# EAGLE design BSPD (EAGLE 9.4.0)
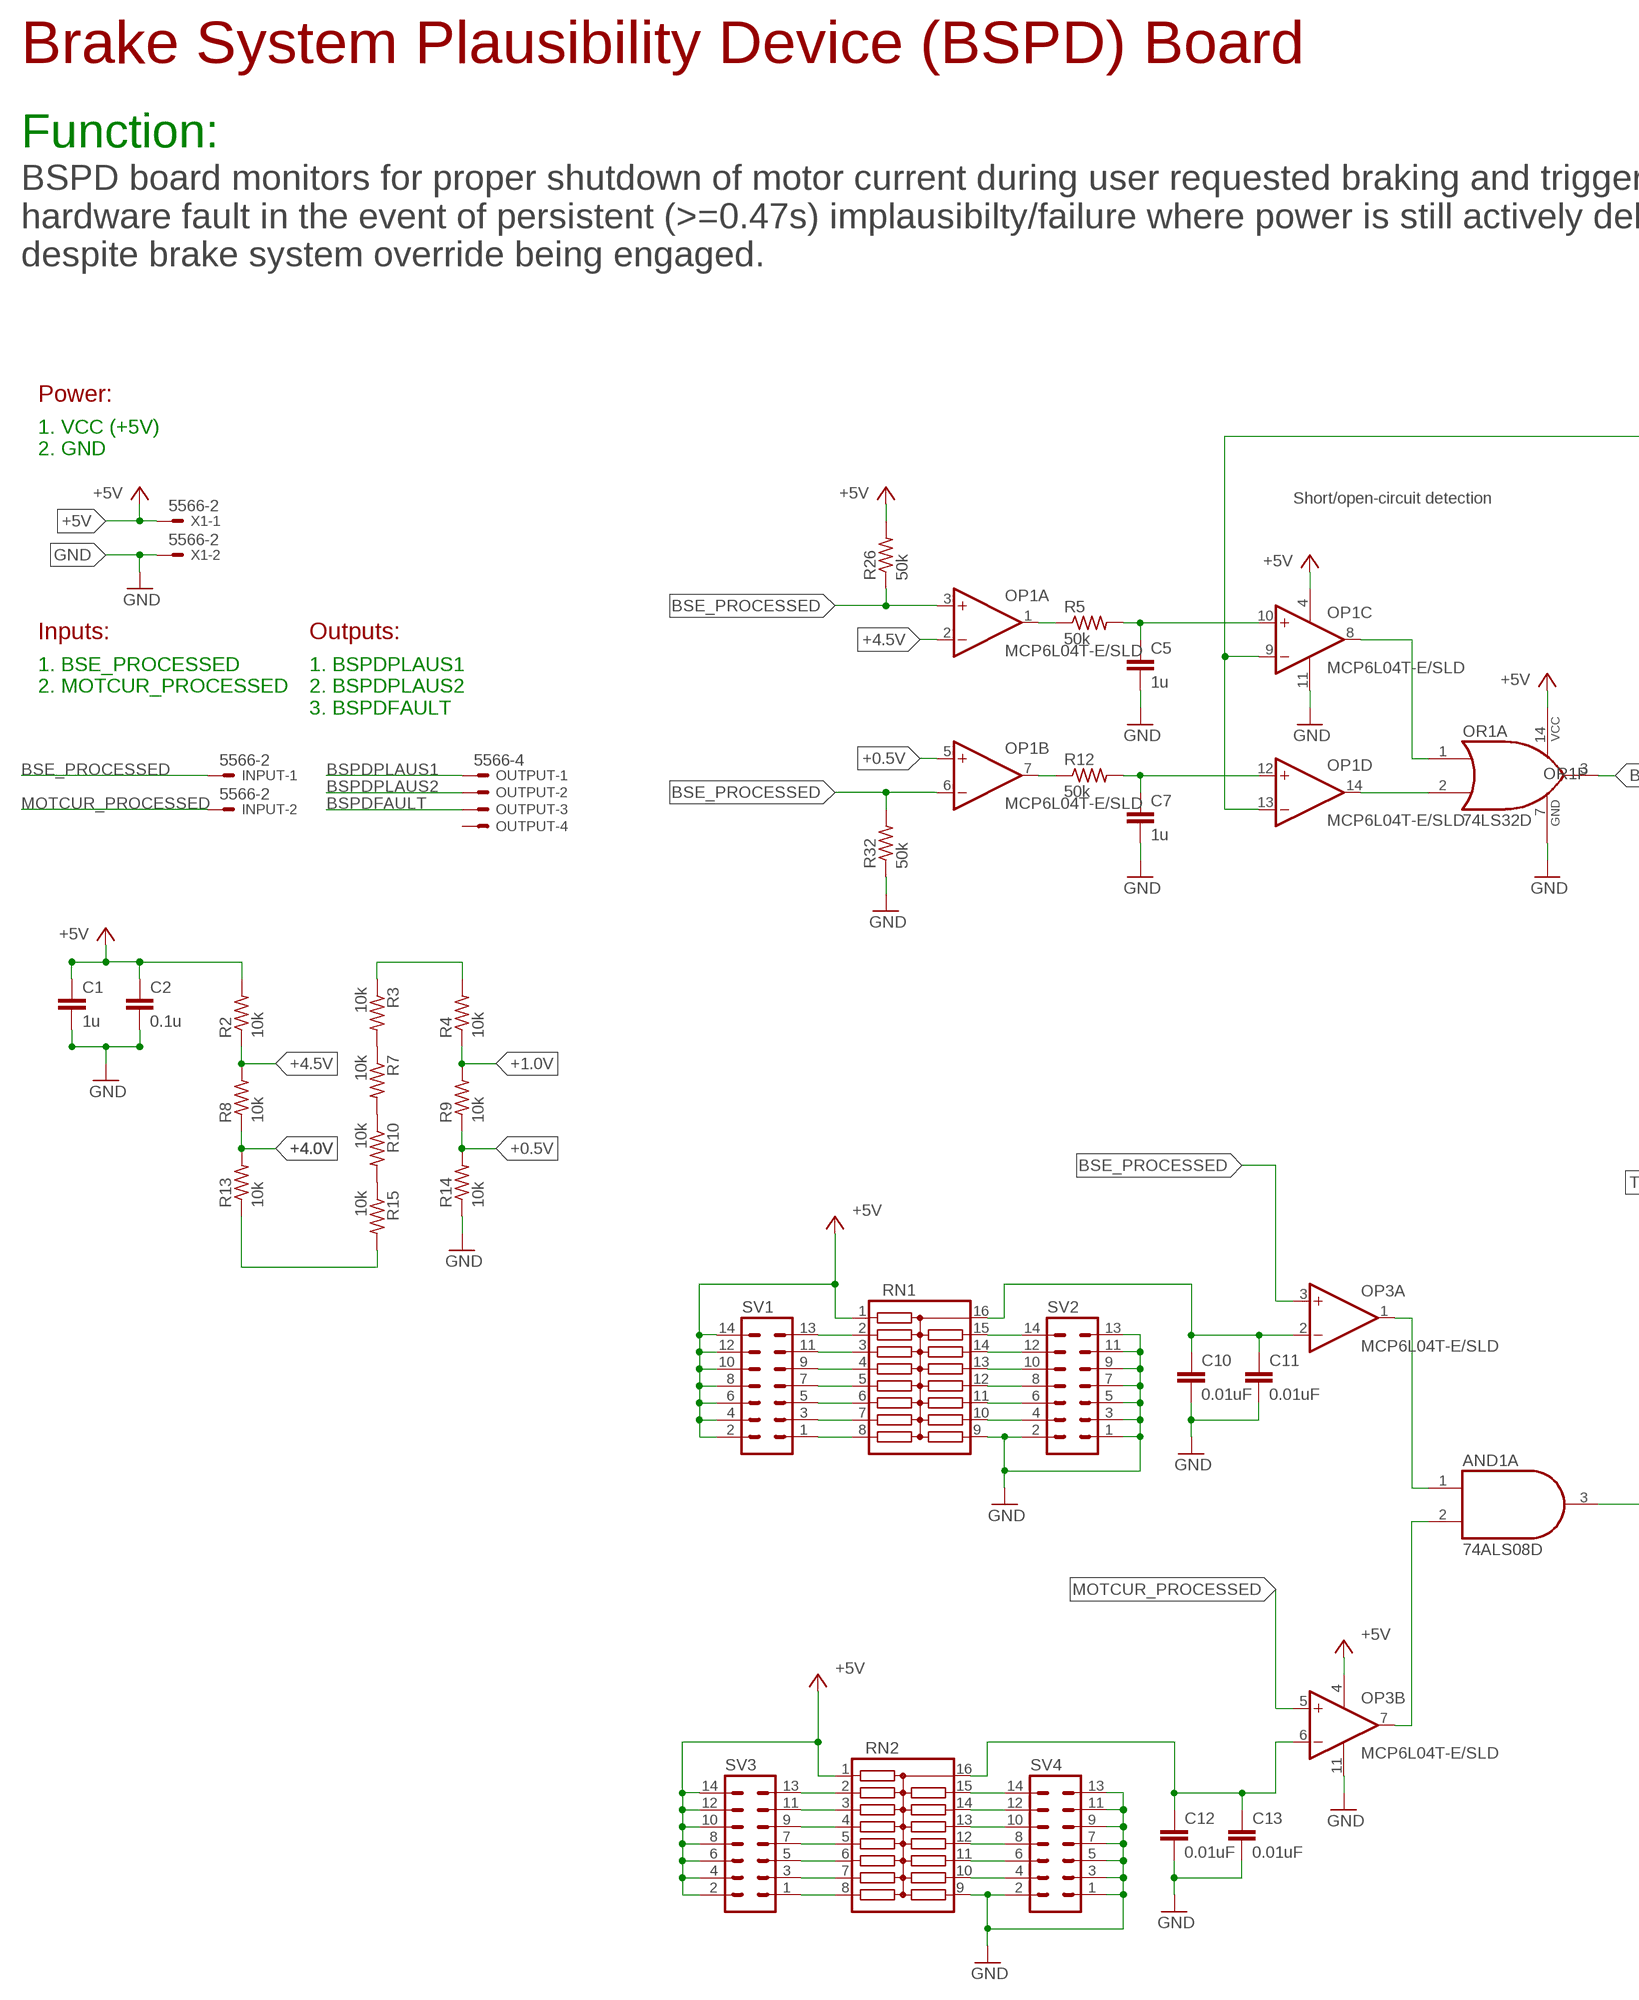
[diagram p0: schematic, sheet 1, part 1 of 2]
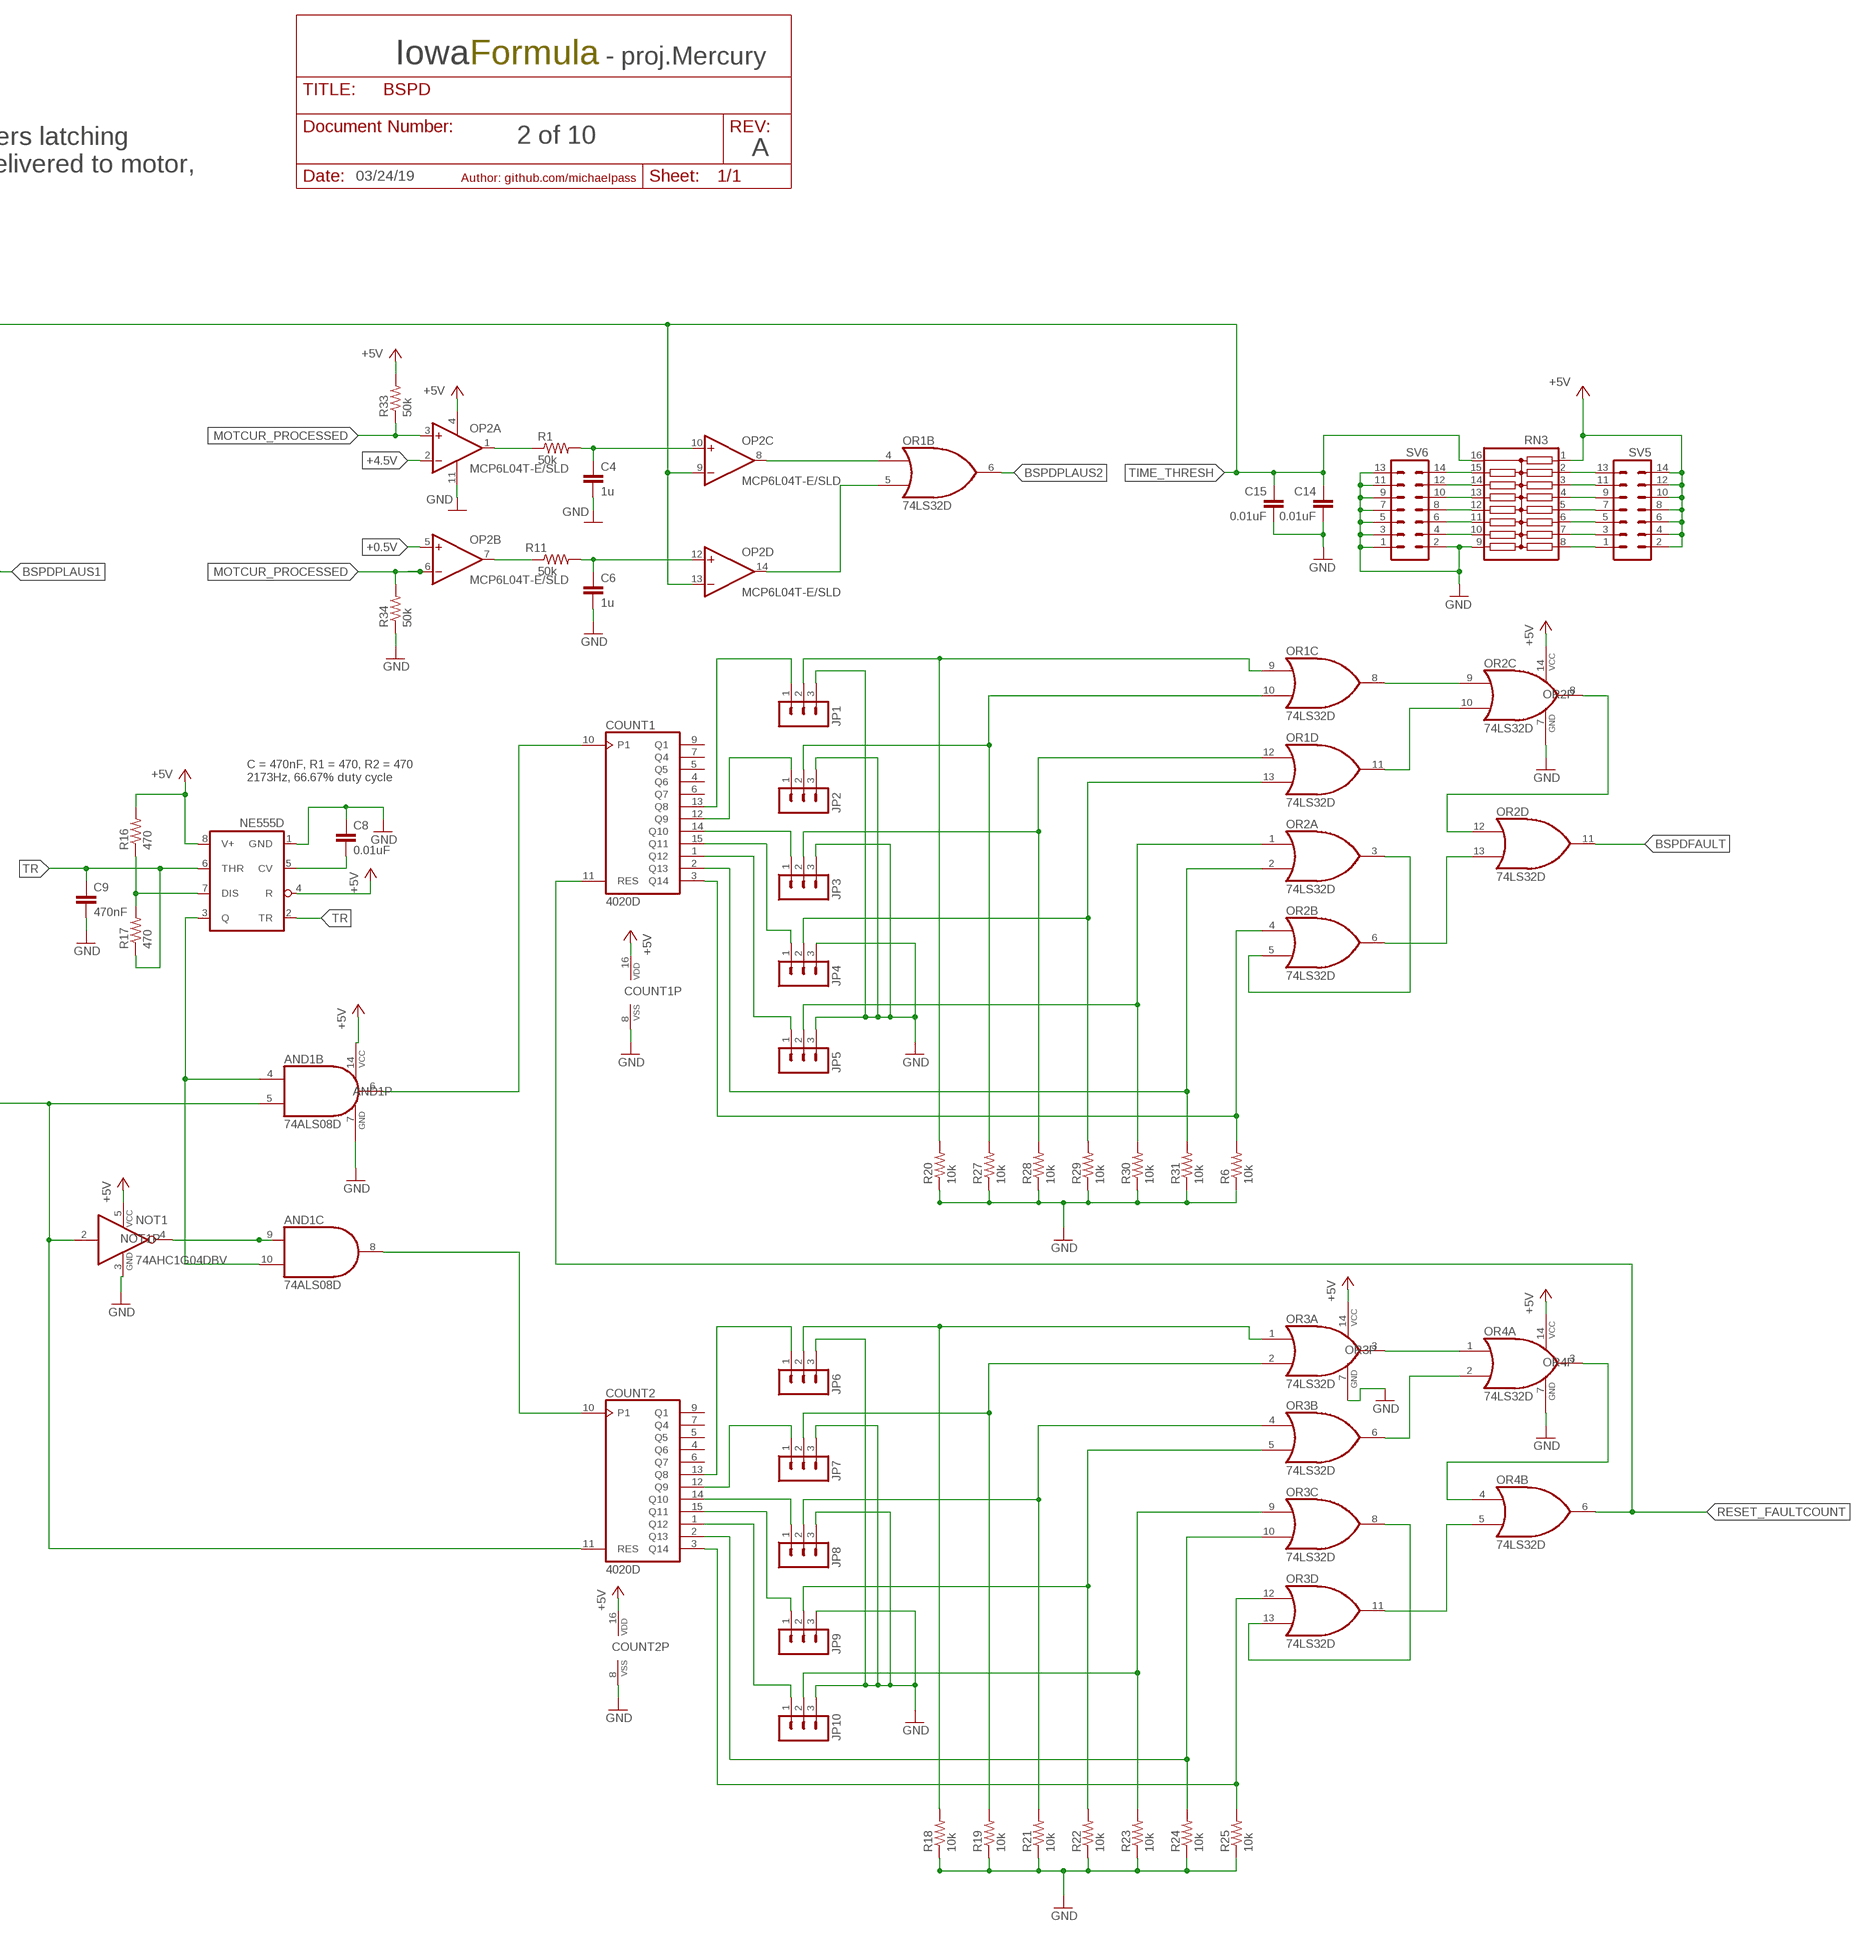
[diagram p1: schematic, sheet 1, part 2 of 2]

## Parts
AND1  74ALS08D  [SO14]
C1  1u  C-EUC0805  [C0805]
C2  0.1u  C-EUC0805  [C0805]
C4  1u  C-EUC0805  [C0805]
C5  1u  C-EUC0805  [C0805]
C6  1u  C-EUC0805  [C0805]
C7  1u  C-EUC0805  [C0805]
C8  0.01uF  C-EUC0805  [C0805]
C9  470nF  C-EUC0805  [C0805]
C10  0.01uF  C-EUC0805  [C0805]
C11  0.01uF  C-EUC0805  [C0805]
C12  0.01uF  C-EUC0805  [C0805]
C13  0.01uF  C-EUC0805  [C0805]
C14  0.01uF  C-EUC0805  [C0805]
C15  0.01uF  C-EUC0805  [C0805]
COUNT1  4020D  [SO16]
COUNT2  4020D  [SO16]
INPUT  5566-2  [5566-2]
JP1  MA03-1  [MA03-1]
JP2  MA03-1  [MA03-1]
JP3  MA03-1  [MA03-1]
JP4  MA03-1  [MA03-1]
JP5  MA03-1  [MA03-1]
JP6  MA03-1  [MA03-1]
JP7  MA03-1  [MA03-1]
JP8  MA03-1  [MA03-1]
JP9  MA03-1  [MA03-1]
JP10  MA03-1  [MA03-1]
NE555D  NE555D  [SO08]
NOT1  74AHC1G04DBV  [SOT23-5]
OP1  MCP6L04T-E/SLD  [SO14]
OP2  MCP6L04T-E/SLD  [SO14]
OP3  MCP6L04T-E/SLD  [SO14]
OR1  74LS32D  [SO14]
OR2  74LS32D  [SO14]
OR3  74LS32D  [SO14]
OR4  74LS32D  [SO14]
OUTPUT  5566-4  [5566-4]
R1  50k  R-US_R0805  [R0805]
R2  10k  R-US_R0805  [R0805]
R3  10k  R-US_R0805  [R0805]
R4  10k  R-US_R0805  [R0805]
R5  50k  R-US_R0805  [R0805]
R6  10k  R-US_R0805  [R0805]
R7  10k  R-US_R0805  [R0805]
R8  10k  R-US_R0805  [R0805]
R9  10k  R-US_R0805  [R0805]
R10  10k  R-US_R0805  [R0805]
R11  50k  R-US_R0805  [R0805]
R12  50k  R-US_R0805  [R0805]
R13  10k  R-US_R0805  [R0805]
R14  10k  R-US_R0805  [R0805]
R15  10k  R-US_R0805  [R0805]
R16  470  R-US_R0805  [R0805]
R17  470  R-US_R0805  [R0805]
R18  10k  R-US_R0805  [R0805]
R19  10k  R-US_R0805  [R0805]
R20  10k  R-US_R0805  [R0805]
R21  10k  R-US_R0805  [R0805]
R22  10k  R-US_R0805  [R0805]
R23  10k  R-US_R0805  [R0805]
R24  10k  R-US_R0805  [R0805]
R25  10k  R-US_R0805  [R0805]
R26  50k  R-US_R0805  [R0805]
R27  10k  R-US_R0805  [R0805]
R28  10k  R-US_R0805  [R0805]
R29  10k  R-US_R0805  [R0805]
R30  10k  R-US_R0805  [R0805]
R31  10k  R-US_R0805  [R0805]
R32  50k  R-US_R0805  [R0805]
R33  50k  R-US_R0805  [R0805]
R34  50k  R-US_R0805  [R0805]
RN1  15RSOMC  [SOMC16]
RN2  15RSOMC  [SOMC16]
RN3  15RSOMC  [SOMC16]
SV1  MA07-2  [MA07-2]
SV2  MA07-2  [MA07-2]
SV3  MA07-2  [MA07-2]
SV4  MA07-2  [MA07-2]
SV5  MA07-2  [MA07-2]
SV6  MA07-2  [MA07-2]
X1  5566-2  [5566-2]

## Nets
+0.5V: OP1.5(B:+IN) OP2.5(B:+IN) R9.1 R14.2
+1.0V: R4.1 R9.2
+4.0V: R8.1 R13.2
+4.5V: OP1.2(A:-IN) OP2.2(A:-IN) R2.1 R8.2
+5V: AND1.14(P:VCC) C1.1 C2.1 COUNT1.16(VDD) COUNT2.16(VDD) NE555D.4(R) NE555D.8(V+) NOT1.5(VCC) OP1.4(P:V+) OP2.4(P:V+) OP3.4(P:V+) OR1.14(P:VCC) OR2.14(P:VCC) OR3.14(P:VCC) OR4.14(P:VCC) R2.2 R16.2 R26.2 R33.2 RN1.1 RN2.1 RN3.1 SV1.2 SV1.4 SV1.6 SV1.8 SV1.10 SV1.12 SV1.14 SV3.2 SV3.4 SV3.6 SV3.8 SV3.10 SV3.12 SV3.14 SV5.2 SV5.4 SV5.6 SV5.8 SV5.10 SV5.12 SV5.14 X1.1
BSE_PROCESSED: INPUT.1 OP1.3(A:+IN) OP1.6(B:-IN) OP3.3(A:+IN) R26.1 R32.2
BSPDFAULT: OR2.11(D:O) OUTPUT.3
BSPDPLAUS1: OR1.3(A:O) OUTPUT.1
BSPDPLAUS2: OR1.6(B:O) OUTPUT.2
GND: AND1.7(P:GND) C1.2 C2.2 C4.2 C5.2 C6.2 C7.2 C8.1 C9.2 C10.2 C11.2 C12.2 C13.2 C14.2 C15.2 COUNT1.8(VSS) COUNT2.8(VSS) JP1.3 JP2.3 JP3.3 JP4.3 JP5.3 JP6.3 JP7.3 JP8.3 JP9.3 JP10.3 NE555D.1(GND) NOT1.3(GND) OP1.11(P:V-) OP2.11(P:V-) OP3.11(P:V-) OR1.7(P:GND) OR2.7(P:GND) OR3.7(P:GND) OR4.7(P:GND) R6.1 R14.1 R18.1 R19.1 R20.1 R21.1 R22.1 R23.1 R24.1 R25.1 R27.1 R28.1 R29.1 R30.1 R31.1 R32.1 R34.1 RN1.9 RN2.9 RN3.9 SV2.1 SV2.2 SV2.3 SV2.5 SV2.7 SV2.9 SV2.11 SV2.13 SV4.1 SV4.2 SV4.3 SV4.5 SV4.7 SV4.9 SV4.11 SV4.13 SV6.1 SV6.2 SV6.3 SV6.5 SV6.7 SV6.9 SV6.11 SV6.13 X1.2
MOTCUR_PROCESSED: INPUT.2 OP2.3(A:+IN) OP2.6(B:-IN) OP3.5(B:+IN) R33.1 R34.2
N$1: R13.1 R15.2
N$2: R10.2 R15.1
N$3: COUNT1.3(Q14) OR2.4(B:I0) R6.2
N$4: R3.2 R7.1
N$5: R3.1 R4.2
N$6: R7.2 R10.1
N$7: OP1.1(A:OUT) R5.1
N$8: OP1.7(B:OUT) R12.1
N$9: C5.1 OP1.10(C:+IN) R5.2
N$10: C7.1 OP1.12(D:+IN) R12.2
N$11: OP2.1(A:OUT) R1.1
N$12: C4.1 OP2.10(C:+IN) R1.2
N$13: C6.1 OP2.12(D:+IN) R11.2
N$14: OP2.7(B:OUT) R11.1
N$15: OR2.3(A:O) OR2.5(B:I1)
N$16: RN1.2 SV1.13
N$17: AND1.3(A:O) AND1.5(B:I1) COUNT2.11(RES) NOT1.2(I)
N$18: OR1.8(C:O) OR2.9(C:I0)
N$19: C10.1 C11.1 OP3.2(A:-IN) RN1.16
N$20: JP1.2 OR1.9(C:I0) R20.2
N$21: C12.1 C13.1 OP3.6(B:-IN) RN2.16
N$22: AND1.4(B:I0) AND1.10(C:I1) NE555D.3(Q)
N$23: OR2.8(C:O) OR2.12(D:I0)
N$25: C8.2 NE555D.5(CV)
N$26: AND1.2(A:I1) OP3.7(B:OUT)
N$27: AND1.1(A:I0) OP3.1(A:OUT)
N$29: AND1.9(C:I0) NOT1.4(O)
N$31: JP6.2 OR3.1(A:I0) R18.2
N$32: COUNT2.13(Q8) JP6.1
N$33: JP7.2 OR3.2(A:I1) R19.2
N$34: JP8.2 OR3.4(B:I0) R21.2
N$35: COUNT2.14(Q10) JP8.1
N$36: JP9.2 OR3.5(B:I1) R22.2
N$37: JP10.2 OR3.9(C:I0) R23.2
N$38: COUNT2.2(Q13) OR3.10(C:I1) R24.2
N$39: COUNT2.12(Q9) JP7.1
N$40: COUNT1.13(Q8) JP1.1
N$41: JP2.2 OR1.10(C:I1) R27.2
N$42: AND1.8(C:O) COUNT2.10(P1)
N$43: AND1.6(B:O) COUNT1.10(P1)
N$44: OP1.8(C:OUT) OR1.1(A:I0)
N$45: OP1.14(D:OUT) OR1.2(A:I1)
N$46: OP2.8(C:OUT) OR1.4(B:I0)
N$47: OP2.14(D:OUT) OR1.5(B:I1)
N$48: JP3.2 OR1.12(D:I0) R28.2
N$49: COUNT1.14(Q10) JP3.1
N$50: JP4.2 OR1.13(D:I1) R29.2
N$51: JP5.2 OR2.1(A:I0) R30.2
N$52: COUNT2.15(Q11) JP9.1
N$53: OR4.3(A:O) OR4.4(B:I0)
N$54: COUNT2.3(Q14) OR3.12(D:I0) R25.2
N$55: COUNT1.2(Q13) OR2.2(A:I1) R31.2
N$56: OR1.11(D:O) OR2.10(C:I1)
N$57: RN1.3 SV1.11
N$58: RN1.4 SV1.9
N$59: RN1.5 SV1.7
N$60: RN1.6 SV1.5
N$61: NE555D.7(DIS) R16.1 R17.2
N$62: RN1.7 SV1.3
N$63: RN1.8 SV1.1
N$64: RN1.15 SV2.14
N$65: RN1.14 SV2.12
N$66: RN1.13 SV2.10
N$67: RN1.12 SV2.8
N$68: RN1.11 SV2.6
N$69: RN1.10 SV2.4
N$70: COUNT1.15(Q11) JP4.1
N$71: RN2.2 SV3.13
N$72: RN2.3 SV3.11
N$73: RN2.4 SV3.9
N$74: RN2.5 SV3.7
N$75: RN2.6 SV3.5
N$76: RN2.7 SV3.3
N$77: RN2.8 SV3.1
N$78: RN2.15 SV4.14
N$79: RN2.14 SV4.12
N$80: RN2.13 SV4.10
N$81: RN2.12 SV4.8
N$82: RN2.11 SV4.6
N$83: RN2.10 SV4.4
N$84: RN3.2 SV5.13
N$85: RN3.3 SV5.11
N$86: RN3.4 SV5.9
N$87: RN3.5 SV5.7
N$88: RN3.6 SV5.5
N$89: RN3.7 SV5.3
N$90: RN3.8 SV5.1
N$91: RN3.15 SV6.14
N$92: RN3.14 SV6.12
N$93: RN3.13 SV6.10
N$94: RN3.12 SV6.8
N$95: RN3.11 SV6.6
N$96: RN3.10 SV6.4
N$97: COUNT1.12(Q9) JP2.1
N$98: OR2.6(B:O) OR2.13(D:I1)
N$100: COUNT1.1(Q12) JP5.1
N$101: COUNT2.1(Q12) JP10.1
N$102: OR3.8(C:O) OR3.13(D:I1)
N$103: OR3.3(A:O) OR4.1(A:I0)
N$104: OR3.6(B:O) OR4.2(A:I1)
N$105: OR3.11(D:O) OR4.5(B:I1)
RESET_FAULTCOUNT: COUNT1.11(RES) OR4.6(B:O)
TIME_THRESH: C14.1 C15.1 OP1.9(C:-IN) OP1.13(D:-IN) OP2.9(C:-IN) OP2.13(D:-IN) RN3.16
TR: C9.1 NE555D.2(TR) NE555D.6(THR) R17.1
Unconnected: AND1.11(D:O) AND1.12(D:I0) AND1.13(D:I1) COUNT1.4(Q6) COUNT1.5(Q5) COUNT1.6(Q7) COUNT1.7(Q4) COUNT1.9(Q1) COUNT2.4(Q6) COUNT2.5(Q5) COUNT2.6(Q7) COUNT2.7(Q4) COUNT2.9(Q1) OP3.8(C:OUT) OP3.9(C:-IN) OP3.10(C:+IN) OP3.12(D:+IN) OP3.13(D:-IN) OP3.14(D:OUT) OR4.8(C:O) OR4.9(C:I0) OR4.10(C:I1) OR4.11(D:O) OR4.12(D:I0) OR4.13(D:I1) OUTPUT.4

## Notes on the sheet
- Brake System Plausibility Device (BSPD) Board
- Iowa | Formula | - proj.Mercury
- Function:
- 2 of 10
- A
- 03/24/19 | Author: github.com/michaelpass
- BSPD board monitors for proper shutdown of motor current during user requested braking and triggers latching
  hardware fault in the event of persistent (>=0.47s) implausibilty/failure where power is still actively delivered to motor,
  despite brake system override being engaged.
- Power:
- 1. VCC (+5V)
  2. GND
- Short/open-circuit detection
- Inputs: | Outputs:
- 1. BSE_PROCESSED
  2. MOTCUR_PROCESSED
- 1. BSPDPLAUS1
  2. BSPDPLAUS2
  3. BSPDFAULT
- C = 470nF, R1 = 470, R2 = 470
  2173Hz, 66.67% duty cycle

## Library data of the parts
AND1 = 74xx-us:74*08: Quad 2-input AND gate
C1 C2 C4-C15 = rcl:C-EU: CAPACITOR, European symbol; SPICEPREFIX: C
COUNT1 COUNT2 = 40xx:4020: 14-stage binary/ripple COUNTER
INPUT X1 = con-molex:5566-2: Mini FIT connector 2 pol Source: http://www.molex.com; MF: MOLEX; OC_FARNELL: 1822072; OC_NEWARK: unknown
JP1-JP10 = con-lstb:MA03-1: PIN HEADER; OC_FARNELL: unknown; OC_NEWARK: unknown
NE555D = linear:*555: TIMER
NOT1 = 74xx-little-us:74*1G04: INVERTER Gate
OP1-OP3 = IowaFormula:MCP6L04T-E/SL: Quad Low-Offset Low-Power OP AMP The OP-11 is pin compatible with the OP-400 , LM148, HA4741, RM4156, and LT1014 operational amplifiers source http://products.analog.com/products/info.asp?product=OP400
OR1 = 74xx-us:74*32: Quad 2-input OR gate; SPICEPREFIX: J
OR2-OR4 = 74xx-us:74*32: Quad 2-input OR gate
OUTPUT = con-molex:5566-4: Mini FIT connector 4 pol Source: http://www.molex.com; MF: MOLEX; OC_FARNELL: unknown; OC_NEWARK: unknown
R1-R34 = rcl:R-US_: RESISTOR, American symbol; SPICEPREFIX: R
RN1-RN3 = resistor-dil:15R: DIL RESISTOR; MPN: SOMC160115R0GDC; OC_FARNELL: unknown; OC_NEWARK: 48P4651
SV1-SV6 = con-lstb:MA07-2: PIN HEADER; OC_FARNELL: unknown; OC_NEWARK: unknown

## Board
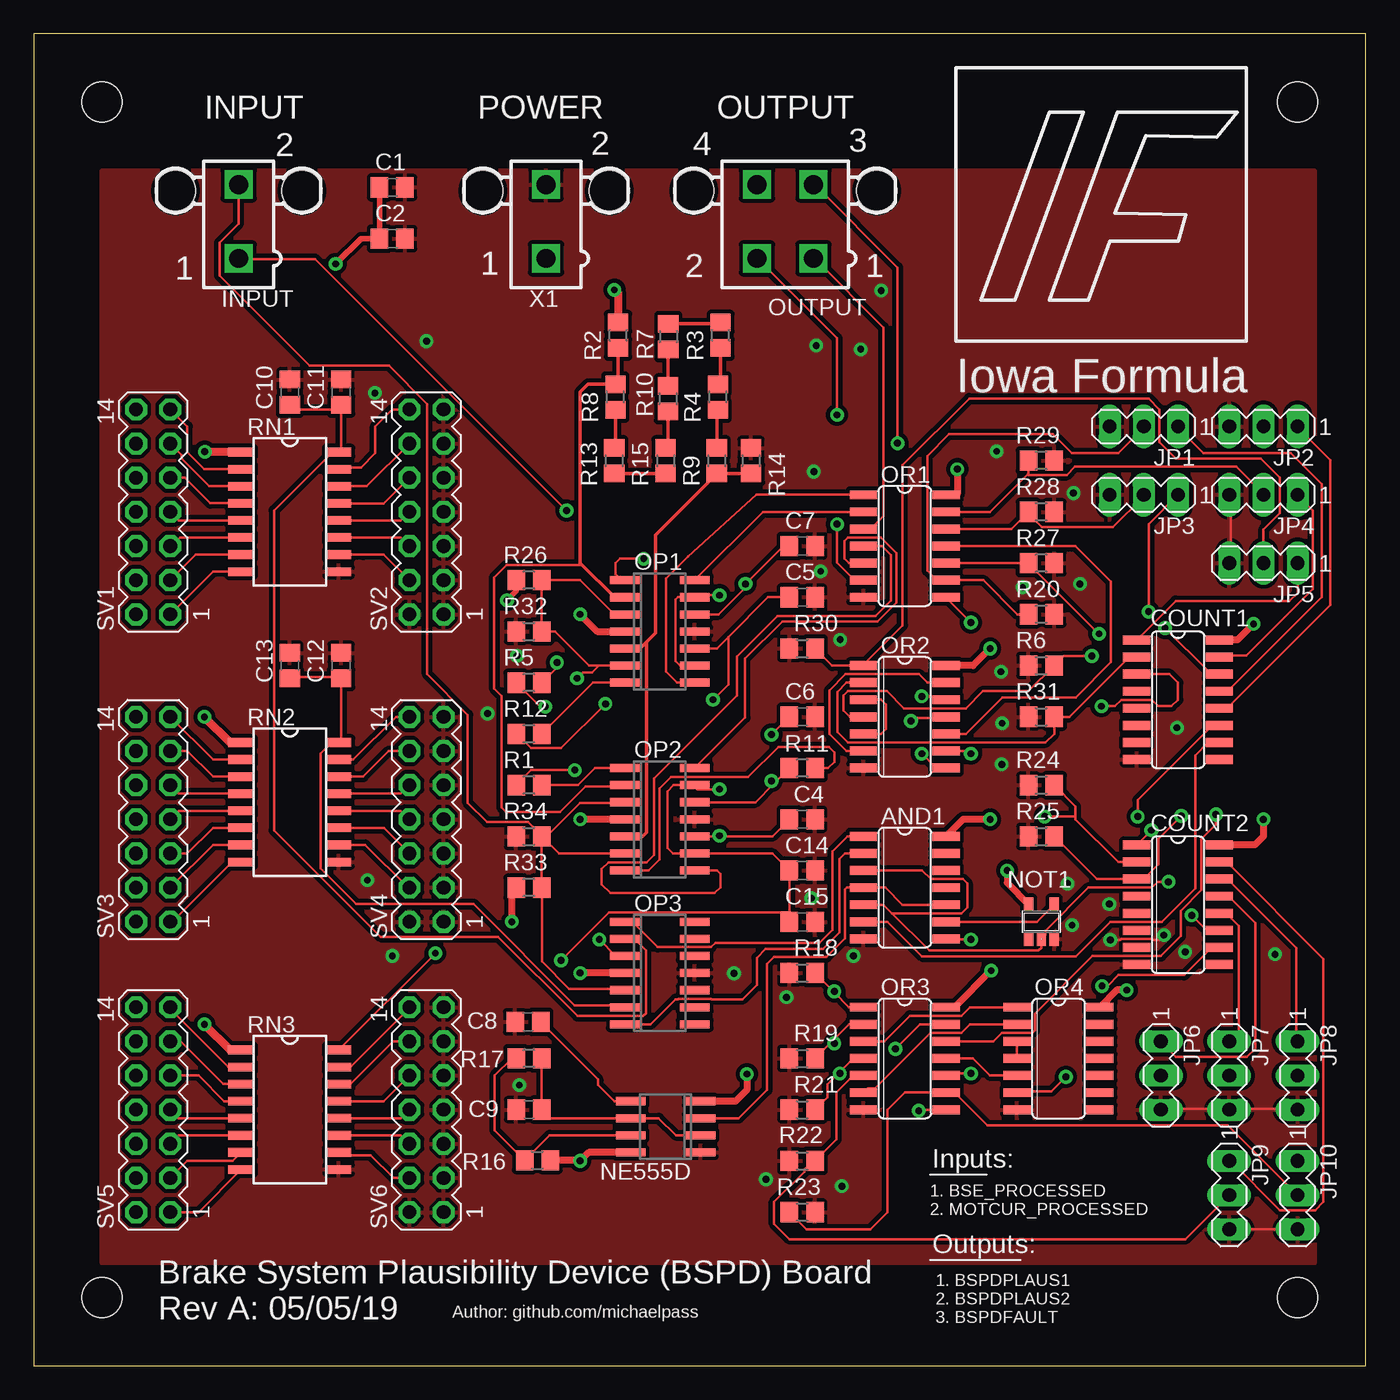
[diagram p2: board, top side]
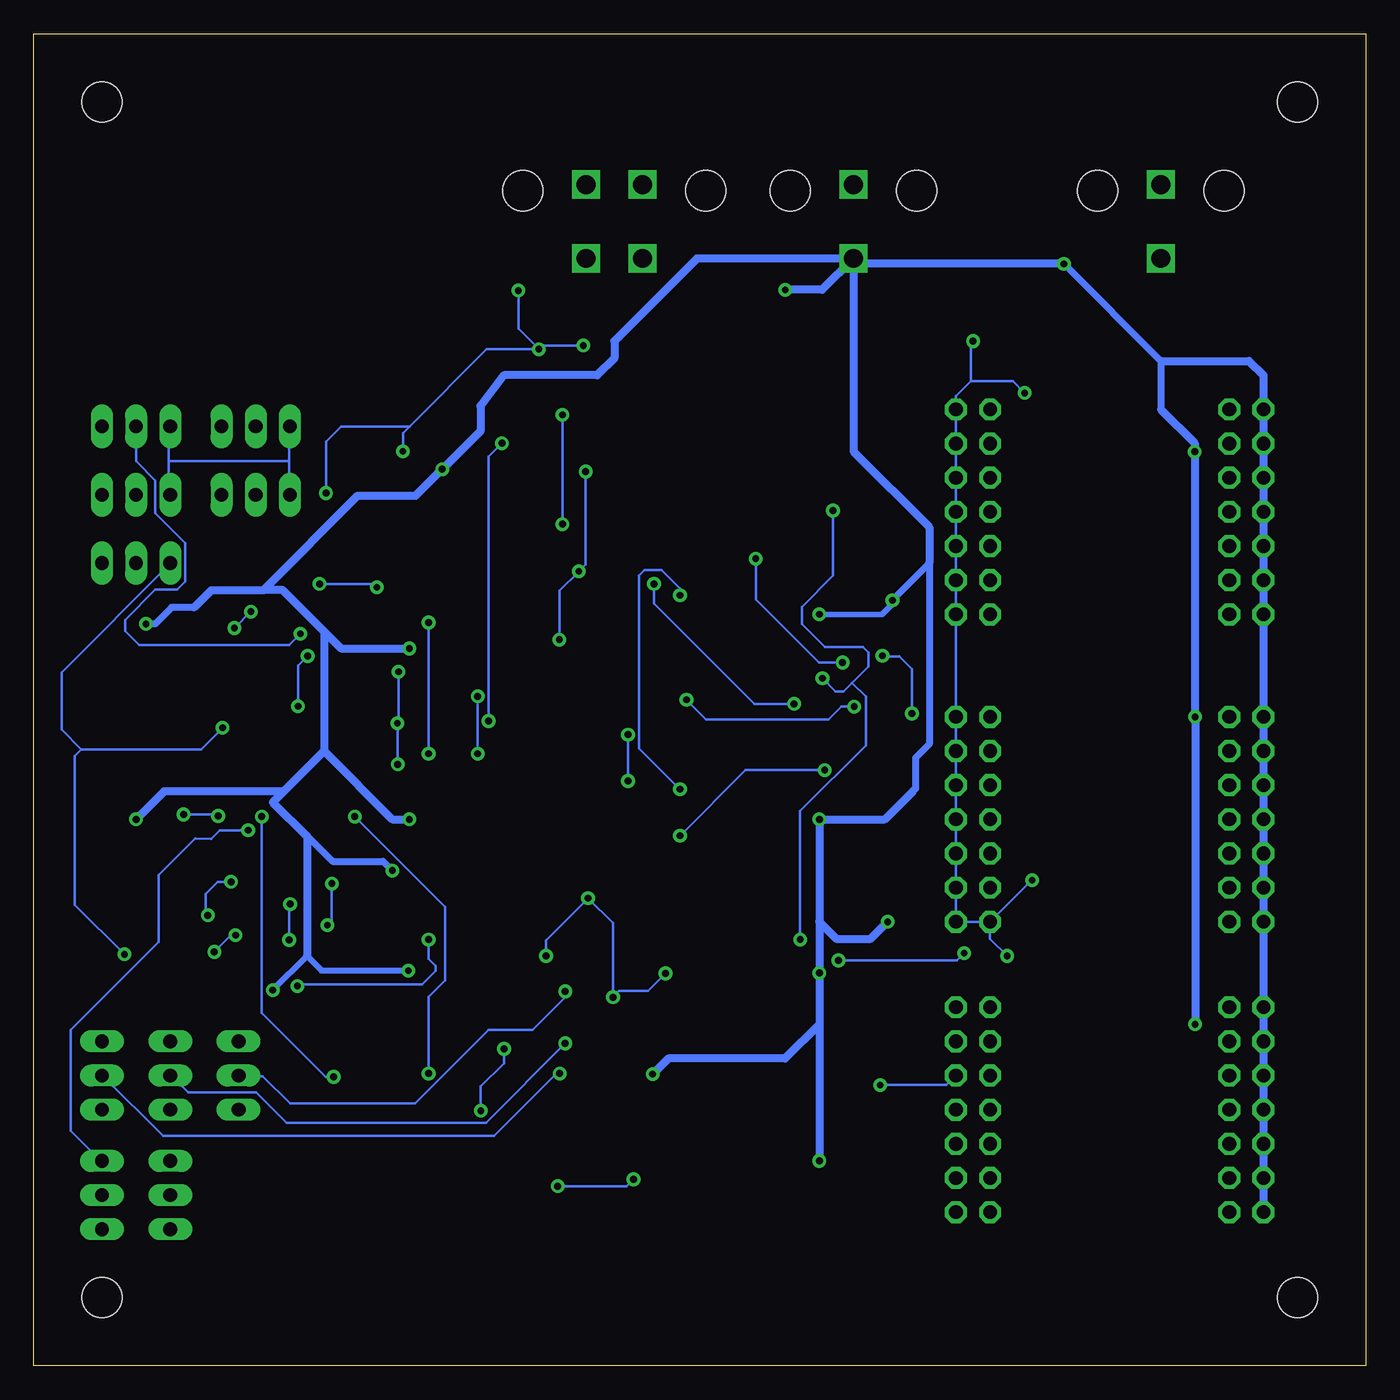
[diagram p3: board, bottom side, seen from below]

Size 99.06 x 99.06 mm. Coordinates in mm from the lower left corner, seen from the top.
Outline: 0,0 99.06,0 99.06,99.06 0,99.06 0,0
Copper layers (1*16): Top 0.035mm / dielectric 1.5mm / Bottom 0.035mm
Design rules "SparkFun *": minimum track width 8mil, minimum drill 20mil, track to track 8mil, track to pad 8mil, pad to pad 8mil, via to via 8mil, smd to smd 8mil, copper to edge 10mil, drill to drill 8mil, minimum pad ring 12mil, minimum via ring 10mil, stop-mask expansion 4mil, vias tented up to drill 25mil, thermal gap 10mil
Holes 3 mm at 93.98,93.98 5.08,93.98 5.08,5.08 93.98,5.08

### Footprints (pad centres in the part's own frame; a part is rotated, then mirrored left to right if it is on the bottom)
SO14 = smd 0.66 x 2.032: 1 -3.81,-3.073; 2 -2.54,-3.073; 3 -1.27,-3.073; 4 0,-3.073; 5 1.27,-3.073; 6 2.54,-3.073; 7 3.81,-3.073; 8 3.81,3.073; 9 2.54,3.073; 10 1.27,3.073; 11 0,3.073; 12 -1.27,3.073; 13 -2.54,3.073; 14 -3.81,3.073
C0805 = smd 1.3 x 1.5: 1 -0.95,0; 2 0.95,0
SO16 = smd 0.66 x 2.032: 1 -4.445,-3.073; 2 -3.175,-3.073; 3 -1.905,-3.073; 4 -0.635,-3.073; 5 0.635,-3.073; 6 1.905,-3.073; 7 3.175,-3.073; 8 4.445,-3.073; 9 4.445,3.073; 10 3.175,3.073; 11 1.905,3.073; 12 0.635,3.073; 13 -0.635,3.073; 14 -1.905,3.073; 15 -3.175,3.073; 16 -4.445,3.073
5566-2 = drill 1.4 square: 1 0,-2.75; 2 0,2.75 | hole 3: 4.7,2.29; -4.7,2.29
MA03-1 = drill 1.016 long: 1 -2.54,0; 2 0,0; 3 2.54,0
SO08 = smd 0.6 x 2.2: 1 -1.905,-2.6; 2 -0.635,-2.6; 3 0.635,-2.6; 4 1.905,-2.6; 5 1.905,2.6; 6 0.635,2.6; 7 -0.635,2.6; 8 -1.905,2.6
SOT23-5 = smd 0.69 x 0.99: 1 -0.95,-1.29; 2 0,-1.29; 3 0.95,-1.29; 4 0.95,1.3; 5 -0.95,1.3
SO14' = smd 0.6 x 2.2: 1 -3.81,-2.6; 2 -2.54,-2.6; 3 -1.27,-2.6; 4 0,-2.6; 5 1.27,-2.6; 6 2.54,-2.6; 7 3.81,-2.6; 8 3.81,2.6; 9 2.54,2.6; 10 1.27,2.6; 11 0,2.6; 12 -1.27,2.6; 13 -2.54,2.6; 14 -3.81,2.6
5566-4 = drill 1.4 square: 1 2.1,-2.75; 2 -2.1,-2.75; 3 2.1,2.75; 4 -2.1,2.75 | hole 3: 6.8,2.29; -6.8,2.29
R0805 = smd 1.3 x 1.5: 1 -0.95,0; 2 0.95,0
SOMC16 = smd 1.91 x 0.64: 1 -3.62,4.445; 2 -3.62,3.175; 3 -3.62,1.905; 4 -3.62,0.635; 5 -3.62,-0.635; 6 -3.62,-1.905; 7 -3.62,-3.175; 8 -3.62,-4.445; 9 3.62,-4.445; 10 3.62,-3.175; 11 3.62,-1.905; 12 3.62,-0.635; 13 3.62,0.635; 14 3.62,1.905; 15 3.62,3.175; 16 3.62,4.445
MA07-2 = drill 1.016 octagon: 1 -7.62,-1.27; 2 -7.62,1.27; 3 -5.08,-1.27; 4 -5.08,1.27; 5 -2.54,-1.27; 6 -2.54,1.27; 7 0,-1.27; 8 0,1.27; 9 2.54,-1.27; 10 2.54,1.27; 11 5.08,-1.27; 12 5.08,1.27; 13 7.62,-1.27; 14 7.62,1.27

### Placement (x,y rotation side)
AND1  64.77,35.56 270 top
C1  26.67,87.63 0 top
C2  26.67,83.82 0 top
C4  57.15,40.64 0 top
C5  57.15,57.15 0 top
C6  57.15,48.26 0 top
C7  57.15,60.96 0 top
C8  36.75,25.58 0 top
C9  36.83,19.05 180 top
C10  19.05,72.39 90 top
C11  22.86,72.39 90 top
C12  22.86,52.07 90 top
C13  19.05,52.07 90 top
C14  57.15,36.83 0 top
C15  57.15,33.02 0 top
COUNT1  85.09,49.53 270 top
COUNT2  85.09,34.29 270 top
INPUT  15.24,85.09 0 top
JP1  82.55,69.85 180 top
JP2  91.44,69.85 180 top
JP3  82.55,64.77 180 top
JP4  91.44,64.77 180 top
JP5  91.44,59.69 180 top
JP6  83.82,21.59 270 top
JP7  88.9,21.59 270 top
JP8  93.98,21.59 270 top
JP9  88.9,12.7 270 top
JP10  93.98,12.7 270 top
NE555D  46.99,17.78 90 top
NOT1  74.93,33.02 0 top
OP1  MCP6L04T-E/SLD  [SO14']  46.56,54.61 270 top
OP2  MCP6L04T-E/SLD  [SO14']  46.56,40.64 270 top
OP3  MCP6L04T-E/SLD  [SO14']  46.56,29.21 270 top
OR1  64.77,60.96 270 top
OR2  64.77,48.26 270 top
OR3  64.77,22.86 270 top
OR4  76.2,22.86 270 top
OUTPUT  55.88,85.09 0 top
R1  36.83,43.18 180 top
R2  43.46,76.63 90 top
R3  51.08,76.63 90 top
R4  50.88,72.03 90 top
R5  36.83,50.8 180 top
R6  74.93,52.07 0 top
R7  47.19,76.53 270 top
R8  43.26,72.03 90 top
R9  50.8,67.31 90 top
R10  47.17,71.91 270 top
R11  57.15,44.45 180 top
R12  36.83,46.99 180 top
R13  43.18,67.31 90 top
R14  53.34,67.31 270 top
R15  46.99,67.31 270 top
R16  37.47,15.29 0 top
R17  36.83,22.86 180 top
R18  57.15,29.21 0 top
R19  57.15,22.86 0 top
R20  74.93,55.88 180 top
R21  57.15,19.05 0 top
R22  57.15,15.24 0 top
R23  57.15,11.43 180 top
R24  74.93,43.18 0 top
R25  74.93,39.37 0 top
R26  36.83,58.42 180 top
R27  74.93,59.69 180 top
R28  74.93,63.5 180 top
R29  74.93,67.31 180 top
R30  57.15,53.34 0 top
R31  74.93,48.26 0 top
R32  36.83,54.61 0 top
R33  36.83,35.56 180 top
R34  36.83,39.37 0 top
RN1  19.05,63.5 0 top
RN2  19.05,41.91 0 top
RN3  19.05,19.05 0 top
SV1  8.89,63.5 90 top
SV2  29.21,63.5 90 top
SV3  8.89,40.64 90 top
SV4  29.21,40.64 90 top
SV5  8.89,19.05 90 top
SV6  29.21,19.05 90 top
X1  38.1,85.09 0 top

### Tracks (layer width: path | path; a pad name or v marks a point on that pad's centre or on a via)
+0.5V
  Top 0.254: R14.2 R9.1 46.23,61.79 46.23,54.48 45.57,53.82 | 45.57,53.82 45.01,53.26 44.03,53.26 OP1.5 | 45.57,53.82 45.57,39.67 45.26,39.37 OP2.5
+1.0V
  Top 0.254: R4.1 50.8,71.01 R9.2
+4.0V
  Top 0.254: R8.1 43.26,68.34 R13.2
+4.5V
  Top 0.203: OP2.2 43.89,43.08 41.05,43.08 39.14,41.17 35.13,41.17 34.8,41.5 34.8,49.81 34.24,50.37 34.24,58.62 35.15,59.54 40.64,59.54 40.72,59.61 | OP1.2 43.89,57.1 43.28,57.1 43.18,57.15
  Top 0.254: R2.1 43.46,73.19 R8.2 41.23,72.98 40.64,72.39 40.64,59.69 40.72,59.61 43.18,57.15
+5V  (via drill 0.51)
  Top 0.203: OR2.14 67.87,52.22 68.48,52.22 68.58,52.07 | 68.68,64.82 67.87,64.82 OR1.14
  Top 0.406: v22.45,81.94 24.33,83.82 C2.1 C1.1 | v35.2,56.92 35.88,57.6 R26.2
  Top 0.508: v71.12,53.34 69.85,52.07 68.58,52.07 | v90.7,55.17 89.51,53.98 COUNT1.16 | v91.44,40.64 91.44,39.37 90.81,38.73 COUNT2.16 | v53.03,21.69 53.03,20.52 52.2,19.68 NE555D.4 | v71.12,40.64 69.11,40.64 AND1.14 | v72.39,36.83 72.39,35.91 NOT1.5 | v81.28,27.94 80.54,27.94 OR4.14 | v71.2,29.39 68.48,26.67 OR3.14 | v40.64,55.88 41.91,54.61 OP1.4 | OP2.4 v40.64,40.64 | OP3.4 v40.64,29.21 | R16.2 40.59,15.29 v40.64,15.24 41.27,15.88 NE555D.8 | v35.56,33.02 35.56,35.24 R33.2 | v68.68,66.67 68.68,64.82
  Top 0.61: v12.72,67.97 15.4,67.97 RN1.1 | v12.7,48.26 14.61,46.35 RN2.1 | v12.7,25.4 14.61,23.5 RN3.1 | v43.18,80.01 43.46,79.73 R2.2
  Bottom 0.203: SV5.4 7.72,14.02 7.62,14.02 | SV5.6 7.72,16.46 7.62,16.46 | SV5.8 7.72,19.1 7.62,19.1 | SV5.10 7.72,21.54 7.62,21.54 | SV5.12 7.72,24.18 7.62,24.18 | SV5.14 7.72,26.62 7.62,26.62 | SV3.2 7.72,33.12 7.62,33.12 | SV3.6 7.72,38.2 7.62,38.2 | SV3.10 7.72,43.28 7.62,43.28 | SV3.14 7.72,48.36 7.62,48.36 | SV1.4 7.72,58.52 7.62,58.52 | SV1.8 7.72,63.6 7.62,63.6 | SV1.12 7.72,68.68 7.62,68.68 | 35.2,56.64 v35.2,56.92 35.2,56.95
  Bottom 0.406: v40.64,55.88 35.97,55.88 35.2,56.64
  Bottom 0.457: v81.28,27.94 78.74,30.48 77.65,29.39 v71.2,29.39
  Bottom 0.508: v22.45,81.94 15.24,74.73 15.24,71.12 | 87.12,56.39 88.8,56.39 90.02,55.17 v90.7,55.17 | v72.39,36.83 73.08,37.52 76.83,37.52 78.74,39.42 | 33.64,42.76 33.48,42.93 33.48,45.21 32.46,46.23 32.46,59.69 35.2,56.95
  Bottom 0.61: X1.1 38.1,68 32.46,62.36 32.46,59.69 | X1.1 49.74,82.34 55.88,76.2 55.88,74.93 57.15,73.66 64.08,73.66 65.84,71.37 65.84,69.49 68.66,66.67 v68.68,66.67 70.66,64.69 74.95,64.69 81.97,57.68 | 81.97,57.68 80.54,57.68 77.47,54.61 | 87.12,56.39 85.83,57.68 81.97,57.68 | 80.47,42.72 89.36,42.72 v91.44,40.64 | 77.47,54.61 77.47,45.72 | 77.47,45.72 80.47,42.72 | 80.47,42.72 81.28,41.91 78.74,39.37 | 33.64,42.76 35.76,40.64 v40.64,40.64 40.64,33.02 | 40.64,33.02 v40.64,29.21 40.64,25.4 | 40.64,33.02 39.37,31.75 36.83,31.75 v35.56,33.02 | 77.47,54.61 76.2,53.34 v71.12,53.34 | 40.64,25.4 43.18,22.86 51.87,22.86 v53.03,21.69 | 40.64,25.4 v40.64,15.24 | 77.47,45.72 72.39,40.64 v71.12,40.64 | 78.74,39.42 78.74,39.37 | 78.74,39.37 78.74,30.48 | 15.24,71.12 12.72,68.61 v12.72,67.97 12.72,48.28 v12.7,48.26 v12.7,25.4 | 15.24,74.73 8.69,74.73 7.62,73.66 SV1.14 7.62,68.68 SV1.12 SV1.10 7.62,63.6 SV1.8 SV1.6 7.62,58.52 SV1.4 SV1.2 7.62,48.36 SV3.14 SV3.12 7.62,43.28 SV3.10 SV3.8 7.62,38.2 SV3.6 SV3.4 7.62,33.12 SV3.2 SV5.14 7.62,26.62 7.62,24.18 SV5.12 SV5.10 7.62,21.54 7.62,19.1 SV5.8 SV5.6 7.62,16.46 7.62,14.02 SV5.4 SV5.2 | v22.45,81.94 37.7,81.94 X1.1 | X1.1 40.43,80.01 v43.18,80.01
BSE_PROCESSED  (via drill 0.51)
  Top 0.203: OP1.3 43.18,55.88 40.64,58.42 R26.1 R32.2 38.76,54.61 41.3,52.07 42.04,52.07 | OP1.6 42.04,52.07 | OP3.3 43.28,30.48 v42.06,31.7 | v40.41,51.13 40.84,51.56 41.53,51.56 42.04,52.07 | v39.62,63.6 20.93,82.3 15.24,82.3 INPUT.1
  Bottom 0.203: v42.06,31.7 42.06,41.25 37.19,46.13 37.19,49.76 38.2,50.77 | v40.41,51.13 39.43,50.15 38.85,50.15 38.21,50.79 38.2,50.77 | v39.62,63.6 39.62,58.75 41.94,56.44 41.94,55.17 40.21,53.44 37.39,53.44 36.98,53.03 36.98,51.99 38.2,50.77
BSPDFAULT  (via drill 0.51)
  Top 0.203: v65.23,47.95 65.43,48.16 67.67,48.16 OR2.11 | v64.24,68.61 64.24,81.66 58.12,87.78 OUTPUT.3
  Bottom 0.203: v65.23,47.95 65.23,67.61 v64.24,68.61
BSPDPLAUS1
  Top 0.203: OR1.3 61.77,62.38 62.38,62.38 63.2,63.2 63.2,77.22 58.12,82.3 OUTPUT.1
BSPDPLAUS2  (via drill 0.51)
  Top 0.203: v59.74,62.59 59.74,59.74 60.96,58.52 61.57,58.52 OR1.6 | v59.74,70.71 59.74,76.4 53.85,82.3 OUTPUT.2
  Bottom 0.203: v59.74,70.71 v59.74,62.59
GND  (via drill 0.51)
  Top 0.203: v84.05,32.03 83.69,31.67 83.23,31.67 83.16,31.75 80.87,31.75 80.8,31.67 v80.06,31.67 | JP10.3 JP9.3 | JP6.3 83.92,19.1 88.8,19.1 JP7.3 89,19.1 93.88,19.1 93.93,19.05 JP8.3 | JP5.3 89,59.74 89,64.62 JP4.3
  Bottom 0.203: v36.12,20.88 31.19,20.88 SV6.9 | v54.46,13.87 54.97,13.36 v60.1,13.36 | v26.67,30.48 27.94,31.75 SV4.2 | SV4.2 24.84,36.12 v24.82,36.12 | SV4.2 SV4.1 SV4.3 SV4.5 SV4.7 SV4.13 SV2.13 30.48,72.11 29.36,73.23 | v33.76,48.51 33.76,51.82 34.7,52.76 35.89,52.76 v35.94,52.81 | v71.98,44.73 71.98,47.75 v72.01,47.78 71.93,47.85 v71.93,51.61 | v60.96,30.48 60.96,31.65 v57.84,34.77 55.98,32.92 v55.98,27.41 55.52,27.86 53.39,27.86 v52.07,29.18 | v25.38,72.34 26.26,73.23 29.36,73.23 | 29.36,73.23 29.36,76.05 v29.21,76.2 | v58.01,66.5 58.01,59.59 v58.52,59.08 59.97,57.63 v59.97,54 | v85.62,30.79 84.38,32.03 v84.05,32.03 | v79.98,34.34 80.06,34.27 v80.06,31.67 | v77.22,32.77 76.89,33.1 v76.89,35.87 | v58.19,75.87 61.21,75.87 v61.49,75.59 | v61.49,75.59 63.02,77.11 v63.02,79.96 | v61.49,75.59 65.38,75.59 71.12,69.85 | v71.6,68 71.6,69.37 71.12,69.85 | 71.12,69.85 76.2,69.85 77.32,68.73 v77.32,64.9 | v73.53,57.89 73.79,58.14 v77.8,58.14 | 80.06,67.26 80.06,69.7 JP1.3 | 80.06,67.26 80.06,64.82 JP3.3 | 89,67.26 89,64.82 JP4.3 | 89,67.26 89,69.7 JP2.3 | 89,67.26 80.06,67.26 | JP5.3 89,59.54 96.98,51.56 96.98,47.32 95.5,45.85 | v92.3,30.61 95.99,34.29 95.99,45.36 95.5,45.85 | v85.01,47.45 86.61,45.85 95.5,45.85
  pour Top (isolate 0.305): 5.08,88.9 95.25,88.9 95.25,7.62 5.08,7.62
MOTCUR_PROCESSED
  Top 0.203: R34.2 39.05,38.1 OP2.6 | R34.2 R33.1 37.8,35.56 37.8,30.07 39.83,28.04 43.89,28.04 OP3.5 | OP2.3 43.89,41.86 40.64,41.86 38,39.22 R34.2 | INPUT.2 15.24,84.94 13.82,83.52 13.82,81.08 20.52,74.37 26.42,74.37 29.26,71.53 29.26,51.44 32.28,48.41 32.28,41.86 33.71,40.44 36.78,40.44 37.8,39.42 R34.2
N$1
  Top 0.254: R13.1 R15.2
N$2
  Top 0.254: R10.2 47.17,68.44 R15.1
N$3  (via drill 0.51)
  Top 0.203: OR2.4 60.68,48.26 60.22,48.72 60.22,49.83 60.55,50.16 63.45,50.16 64.72,48.9 69.32,48.9 70.59,50.16 73.97,50.16 R6.2 76.59,52.78 v78.69,52.78 | v79.4,49.05 80.39,49.05 80.87,49.53 83.16,49.53 83.64,49.05 84.61,49.05 85.09,49.53 85.09,50.8 84.45,51.44 COUNT1.3
  Bottom 0.203: v78.69,52.78 79.4,52.07 v79.4,49.05
N$4
  Top 0.254: R7.1 50.98,77.48 R3.2
N$5
  Top 0.254: R3.1 51.08,73.19 R4.2
N$6
  Top 0.254: R10.1 47.17,75.56 R7.2
N$7  (via drill 0.51)
  Top 0.203: R5.1 38.91,51.93 v38.91,52.3 | v45.36,60.02 43.59,60.02 43.26,59.69 43.26,58.87 43.7,58.42 OP1.1
  Bottom 0.203: v38.91,52.3 40.66,52.3 45.36,57 v45.36,60.02
N$8
  Top 0.203: OP1.7 41.59,50.8 R12.1
N$9  (via drill 0.51)
  Top 0.203: OP1.10 50.8,53.34 51.65,54.19 | C5.1 54.61,57.15 51.65,54.19 | R5.2 37.66,49.02 v38.05,49.02 | v50.52,49.53 51.65,50.66 51.65,54.19
  Bottom 0.203: v38.05,49.02 38.99,49.02 39.95,48.06 49.05,48.06 v50.52,49.53
N$10  (via drill 0.51)
  Top 0.203: OP1.12 50.93,55.88 52.93,57.89 v52.93,58.14 55.75,60.96 C7.1 | R12.2 35.95,46.99 37,45.94 39.23,45.94 v42.52,49.23
  Bottom 0.203: v42.52,49.23 45.47,49.23 52.93,56.69 v52.93,58.14
N$11
  Top 0.203: OP2.1 41.73,44.45 40.46,43.18 R1.1
N$12  (via drill 0.51)
  Top 0.203: C4.1 54.93,39.37 51,39.37 | 51,39.37 OP2.10 | v40.23,44.3 36.98,44.3 35.97,43.28 R1.2 | v51,39.42 51,39.37
  Bottom 0.203: v40.23,44.3 46.13,44.3 v51,39.42
N$13  (via drill 0.51)
  Top 0.203: 55.05,43.3 53.66,41.91 OP2.12 | 55.05,43.3 R11.2 | v54.86,46.94 56.08,48.16 C6.1 | 55.05,43.3 v54.86,43.48
  Bottom 0.203: v54.86,43.48 v54.86,46.94
N$14
  Top 0.203: OP2.7 45.72,36.83 46.53,37.64 46.53,42.93 47.39,43.78 53.13,43.78 55.37,46.02 59.13,46.02 59.54,45.62 59.54,44.91 59.08,44.45 R11.1
N$15
  Top 0.203: OR2.5 63.02,46.99 63.37,47.35 63.37,49.17 62.99,49.55 61.72,49.55 OR2.3
N$16
  Top 0.203: RN1.2 12.7,66.67 11.43,67.94 11.43,69.85 SV1.13
N$17  (via drill 0.51)
  Top 0.203: AND1.3 66.07,36.83 66.7,36.2 69.11,36.2 69.42,35.89 69.42,34.09 68.99,33.66 63.83,33.66 | 63.83,33.66 63.2,34.29 AND1.5 | 63.83,33.66 66.6,30.89 74.73,30.89 74.93,31.09 NOT1.2 75.23,32.03 75.23,32.35 78.44,35.56 83.16,35.56 83.59,35.99 v84.38,35.99 | v86.11,33.5 87.22,32.38 COUNT2.11
  Bottom 0.203: v84.38,35.99 85.37,35.99 86.26,35.1 86.26,33.45 86.16,33.45 v86.11,33.5
N$18  (via drill 0.51)
  Top 0.203: OR2.9 69.49,45.72 v69.7,45.52 | v69.7,55.27 67.87,57.1 OR1.8
  Bottom 0.203: v69.7,55.27 v69.7,45.52
N$19
  Top 0.203: 22.86,71.12 22.86,68.14 RN1.16 22.55,67.87 22.15,67.87 17.88,63.6 17.88,39.83 25.81,31.9 34.54,31.9 40.44,26.01 45.31,26.01 45.52,26.21 45.52,30.89 44.7,31.7 44.09,31.7 OP3.2 | 22.86,71.12 C11.1 | C10.1 19.37,71.12 22.86,71.12
N$20
  Top 0.203: R20.2 73.15,55.88 70.61,58.42 OR1.9 67.67,58.52 67.06,58.52 66.45,59.13 66.45,67.67 68.07,69.29 75.79,69.29 77.22,67.87 80.67,67.87 82.5,69.7 JP1.2
N$21
  Top 0.203: C13.1 19.1,51.21 22.76,51.21 C12.1 22.86,46.55 RN2.16 22.55,46.33 22.15,46.33 21.34,45.52 21.34,36.98 23.98,34.34 32.72,34.34 40.23,26.82 43.89,26.82 OP3.6
N$22
  Top 0.203: AND1.10 64.62,34.29 63.35,35.56 AND1.4 60.48,35.56 60.33,35.41 60.33,31.77 58.95,30.4 55.07,30.4 54.53,29.87 54.53,20.52 52.43,18.41 NE555D.3
N$23  (via drill 0.51)
  Top 0.203: v66.04,45.52 67.06,44.5 67.67,44.5 OR2.8 | v66.04,49.78 67.46,49.78 67.67,49.58 OR2.12
  Bottom 0.203: v66.04,49.78 v66.04,45.52
N$25
  Top 0.203: C8.2 41.96,21.32 41.96,20.9 43.18,19.68 NE555D.5
N$26
  Top 0.203: AND1.2 60.33,38.1 59.92,37.69 59.92,32.23 58.67,30.99 54.42,30.99 53.77,30.34 53.77,28.32 52.7,27.25 50.41,27.25 50.38,27.27 47.93,27.27 47.91,27.25 47.73,27.25 45.87,25.4 OP3.7
N$27
  Top 0.203: AND1.1 60.53,39.37 59.41,38.25 59.41,32.41 58.45,31.45 50.68,31.45 50.38,31.14 46.39,31.14 44.52,33.02 OP3.1
N$29
  Top 0.203: AND1.9 74.58,33.02 NOT1.4
N$31  (via drill 0.51)
  Top 0.203: R18.2 59.51,27.8 | 59.51,27.8 60.64,26.67 60.96,26.67 60.96,26.62 61.57,26.62 OR3.1 | v59.54,27.84 59.51,27.8
  Bottom 0.203: v59.54,27.84 59.33,27.84 59.33,27.64 61.98,24.99 65.23,24.99 70.71,19.51 79.98,19.51 82.02,21.54 83.72,21.54 JP6.2
N$32
  Top 0.203: COUNT2.13 88.19,34.75 89,34.75 90.83,32.92 90.83,23.57 90.22,22.96 84.94,22.96 83.92,23.98 JP6.1
N$33  (via drill 0.51)
  Top 0.203: R19.2 59.48,24.24 | 59.48,24.24 60.64,25.4 OR3.2 | v59.54,23.98 59.54,24.18 59.48,24.24
  Bottom 0.203: v59.54,23.98 65.43,18.09 80.26,18.09 82.5,20.32 87.58,20.32 88.8,21.54 JP7.2
N$34  (via drill 0.51)
  Top 0.203: R21.2 59.03,19.98 59.03,20.93 59.89,21.79 | 59.89,21.79 60.91,22.81 60.96,22.76 61.57,22.76 OR3.4 | v59.94,21.74 59.89,21.79
  Bottom 0.203: v59.94,21.74 60.17,21.74 64.82,17.09 89.43,17.09 93.88,21.54 JP8.2
N$35
  Top 0.203: COUNT2.14 88.19,36.17 88.8,36.17 93.88,31.09 93.88,24.18 JP8.1
N$36
  Top 0.203: OR3.5 61.57,21.54 60.96,21.54 60.94,21.57 59.69,20.32 59.69,16.83 R22.2 57.91,15.24 57.3,14.63 57.3,14.43 55.07,12.19 55.07,10.57 56.21,9.42 85.62,9.42 JP9.2
N$37
  Top 0.203: R23.2 57.47,10.16 62.23,10.16 63.5,11.43 63.5,19.05 64.77,20.32 OR3.9 68.48,20.32 70.92,17.88 88.8,17.88 JP10.2
N$38  (via drill 0.51)
  Top 0.203: R24.2 77.47,41.59 77.47,40.84 | 77.47,40.84 77.47,40.64 80.64,37.47 COUNT2.2 | v69.7,21.74 67.87,21.74 OR3.10 | 77.47,40.84 v75.18,40.84
  Bottom 0.203: v69.7,21.74 69.7,27.43 68.48,28.65 68.48,34.14 v75.18,40.84
N$39
  Top 0.203: COUNT2.12 88.19,33.53 88.8,33.53 89.61,32.72 89.61,24.79 89,24.18 JP7.1
N$40
  Top 0.203: COUNT1.13 88.19,50.19 88.8,50.19 95.78,57.17 95.78,65.56 93.47,67.87 86.97,67.87 85.14,69.7 JP1.1
N$41  (via drill 0.51)
  Top 0.203: OR1.10 R27.2 73.98,59.67 v79.22,54.43
  Bottom 0.203: JP2.2 91.44,67.26 90.02,65.84 90.02,63.4 87.78,61.16 87.78,58.32 88.39,57.71 90.02,57.71 92.25,55.47 92.25,54.63 91.21,53.59 80.06,53.59 v79.22,54.43
N$42  (via drill 0.51)
  Top 0.203: v69.7,31.7 67.87,31.7 AND1.8 | v79.45,28.25 79.86,28.25 80.67,29.06 85.55,29.06 87.58,31.09 87.99,31.09 COUNT2.10
  Bottom 0.203: v69.7,31.7 69.7,30.28 69.16,29.74 69.16,29.36 70.18,28.35 79.35,28.35 v79.45,28.25
N$43
  Top 0.203: AND1.6 63.5,33.02 66.06,30.46 77.49,30.46 80.06,33.02 83.87,33.02 86.36,35.51 86.36,45.39 87.33,46.35 COUNT1.10
N$44
  Top 0.203: OP1.8 47.83,50.8 47.02,51.61 47.02,58.55 48.64,60.17 53.75,64.77 OR1.1
N$45
  Top 0.203: OP1.14 54.24,63.5 OR1.2
N$46
  Top 0.203: OP2.8 50.8,36.83 51.05,36.58 51.05,35.59 50.62,35.15 42.9,35.15 42.24,35.81 42.24,36.94 42.73,37.44 45.59,37.44 46.13,37.97 46.13,43.69 52.3,49.86 52.3,52.76 55.3,55.75 62.59,55.75 63.75,56.92 63.75,60.27 63.07,60.96 OR1.4
N$47
  Top 0.203: OP2.14 52.91,48.2 52.91,52.58 55.68,55.35 62.75,55.35 64.16,56.75 64.16,60.44 63.01,61.59 60.55,61.59 60.27,61.31 60.27,60.02 60.6,59.69 OR1.5
N$48
  Top 0.203: OR1.12 72.71,62.23 R28.2 73.97,63.4 74.98,62.38 80.26,62.38 82.5,64.62 JP3.2
N$49  (via drill 0.51)
  Top 0.203: v84.12,54.86 87.38,51.61 87.99,51.61 COUNT1.14 | v82.91,56.08 82.91,62.59 JP3.1
  Bottom 0.203: v82.91,56.08 v84.12,54.86
N$50
  Top 0.203: OR1.13 71.12,63.5 73.91,66.29 | 73.91,66.29 73.98,66.36 R29.2 | JP4.2 91.44,64.82 89.41,66.85 77.42,66.85 76.81,66.24 73.97,66.24 73.91,66.29
N$51
  Top 0.203: R30.2 59.37,52.07 OR2.1 61.77,52.22 64.62,55.07 64.62,66.98 69.57,71.93 82.91,71.93 83.72,71.12 83.72,68.68 84.94,67.46 91.24,67.46 92.66,66.04 92.66,63.4 91.44,62.18 JP5.2
N$52
  Top 0.203: COUNT2.15 88.19,37.39 88.8,37.39 95.91,30.28 95.91,12.19 95.3,11.58 92.66,11.58 89,15.24 JP9.1
N$53
  Top 0.203: OR4.3 OR4.4
N$54  (via drill 0.51)
  Top 0.203: R25.2 79.06,36.2 COUNT2.3 82.09,36.17 82.5,36.17 82.55,36.22 83.62,37.29 83.62,39.17 v85.34,40.89 | OR3.12 71.35,24.13 71.98,24.77 74.27,24.77 74.45,24.94 74.45,26.19 78.74,30.48 83.82,30.48 85.29,31.95 85.29,33.84 86.84,35.39 86.84,39.19 87.91,40.26 v87.91,41
  Bottom 0.203: v87.91,41 85.45,41 v85.34,40.89
N$55
  Top 0.203: OR2.2 60.45,50.8 59.77,50.11 59.77,47.14 60.55,46.35 75.23,46.35 75.88,47 R31.2 77.02,48.26 81.47,52.7 COUNT1.2
N$56
  Top 0.203: OR1.11 77.47,60.96 80.11,58.32 80.11,52.32 77.5,49.71 72.03,49.71 69.32,46.99 OR2.10
N$57
  Top 0.203: RN1.3 14.16,65.41 14.15,65.42 13.05,65.42 11.02,67.45 11.02,67.72 SV1.11
N$58
  Top 0.203: RN1.4 13.14,64.14 11.25,66.04 SV1.9
N$59
  Top 0.203: RN1.5 10.79,62.87 SV1.7
N$60
  Top 0.203: RN1.6 10.88,61.59 10.2,60.92 SV1.5
N$61
  Top 0.203: R17.2 35.56,22.86 34.29,21.59 34.29,17.52 R16.1 38.37,17.14 NE555D.7
N$62
  Top 0.203: RN1.7 12.06,60.33 SV1.3
N$63
  Top 0.203: RN1.8 13.34,59.05 SV1.1
N$64
  Top 0.203: RN1.15 22.8,66.8 24.33,66.8 25.4,67.87 25.4,69.85 26.67,71.12 SV2.14
N$65
  Top 0.203: RN1.14 24.77,65.41 SV2.12
N$66
  Top 0.203: RN1.13 23.58,64.14 26.04,64.14 SV2.10
N$67
  Top 0.203: RN1.12 27.3,62.87 SV2.8
N$68
  Top 0.203: RN1.11 24.37,61.59 27.3,61.59 SV2.6
N$69
  Top 0.203: SV2.4 26.04,60.33 24.52,60.33 RN1.10
N$70
  Top 0.203: COUNT1.15 88.19,52.83 90.17,52.83 95.1,57.76 95.1,63.6 94.08,64.62 JP4.1
N$71
  Top 0.203: RN2.2 13.34,45.09 SV3.13
N$72
  Top 0.203: RN2.3 13.34,43.81 11.43,45.72 SV3.11
N$73
  Top 0.203: RN2.4 10.79,42.55 SV3.9
N$74
  Top 0.203: RN2.5 10.79,41.27 SV3.7
N$75
  Top 0.203: RN2.6 13.34,40.01 11.43,38.1 SV3.5
N$76
  Top 0.203: RN2.7 13.34,38.73 SV3.3
N$77
  Top 0.203: RN2.8 14.76,37.47 10.31,33.02 SV3.1
N$78
  Top 0.203: RN2.15 23.77,45.09 26.95,48.26 SV4.14
N$79
  Top 0.203: RN2.14 22.68,43.83 24.51,43.83 26.41,45.72 SV4.12
N$80
  Top 0.203: RN2.13 27.3,42.55 SV4.10
N$81
  Top 0.203: RN2.12 24.27,41.27 27.3,41.27 SV4.8
N$82
  Top 0.203: RN2.11 22.7,39.98 26.06,39.98 SV4.6
N$83
  Top 0.203: SV4.4 27.83,35.56 24.64,38.75 22.68,38.75 RN2.10
N$84
  Top 0.203: SV5.13 10.16,26.54 14.45,22.25 15.4,22.25 RN3.2
N$85
  Top 0.203: RN3.3 14.11,20.95 10.93,24.13 SV5.11
N$86
  Top 0.203: SV5.9 12.28,21.59 14.18,19.68 RN3.4
N$87
  Top 0.203: RN3.5 13.96,18.41 10.79,18.41 SV5.7
N$88
  Top 0.203: RN3.6 10.79,17.14 SV5.5
N$89
  Top 0.203: SV5.3 11.43,15.24 14.79,15.24 RN3.7
N$90
  Top 0.203: RN3.8 12.26,11.43 SV5.1
N$91
  Top 0.203: RN3.15 22.71,22.26 23.6,22.26 27.94,26.6 SV6.14
N$92
  Top 0.203: RN3.14 23.56,20.95 26.74,24.13 SV6.12
N$93
  Top 0.203: SV6.10 26.04,19.68 RN3.13
N$94
  Top 0.203: SV6.8 27.3,18.41 RN3.12
N$95
  Top 0.203: SV6.6 27.3,17.14 24.25,17.14 RN3.11
N$96
  Top 0.203: SV6.4 26.76,13.97 25.07,15.66 22.88,15.66 RN3.10
N$97
  Top 0.203: COUNT1.12 88.19,48.97 88.8,48.97 96.42,56.59 96.42,67.36 94.08,69.7 JP2.1
N$98
  Top 0.203: OR2.6 60.43,45.72 59.16,46.99 59.16,50.22 60.38,51.44 65.81,51.44 66.45,50.8 OR2.13
N$100
  Top 0.203: COUNT1.1 84.91,56.87 93.37,56.87 93.98,57.48 JP5.1
N$101  (via drill 0.51)
  Top 0.203: v83.11,39.83 COUNT2.1
  Bottom 0.203: v83.11,39.83 84.05,39.83 85.22,39.82 85.85,39.2 87.06,39.2 89.76,36.5 89.76,31.52 96.32,24.97 96.32,17.48 94.08,15.24 JP10.1
N$102  (via drill 0.51)
  Top 0.203: OR3.8 65.89,19.05 v65.81,18.97 | v64.08,23.57 65.91,25.4 OR3.13
  Bottom 0.203: v64.08,23.57 64.08,22.5 65.81,20.78 v65.81,18.97
N$103
  Top 0.203: OR3.3 63.24,24.13 65.15,26.04 68.99,26.04 69.62,26.67 OR4.1
N$104
  Top 0.203: OR3.6 62.03,20.65 62.56,20.65 66.67,24.77 68.99,24.77 69.62,25.4 OR4.2
N$105
  Top 0.203: OR3.11 69.85,22.86 71.12,21.59 OR4.5
RESET_FAULTCOUNT  (via drill 0.51)
  Top 0.203: v76.76,21.49 75.69,20.42 73.23,20.42 OR4.6 | v82.09,40.84 82.09,42.06 87.58,47.55 87.99,47.55 COUNT1.11
  Bottom 0.203: v76.76,21.49 77.34,21.49 82.09,26.24 v82.09,40.84
TIME_THRESH  (via drill 0.51)
  Top 0.203: OP1.9 48.06,52.07 47.73,52.4 47.73,56.97 47.9,57.15 OP1.13 49.17,57.3 v51,57.3 | v29.87,30.68 22.76,23.57 RN3.16 | v39.22,30.15 42.8,33.73 56.29,33.73 C15.1 C14.1 54.93,38.1 OP2.9 47.52,38.1 47.12,38.51 47.12,42.72 47.57,43.18 OP2.13 49.17,43.08 49.38,42.88 v51,42.88
  Bottom 0.203: v39.22,30.15 30.4,30.15 v29.87,30.68 | v51,57.3 51,57.81 52.38,59.18 53.62,59.18 54.05,58.75 54.05,45.92 v51,42.88
TR
  Top 0.203: R17.1 C9.1 38.41,18.41 NE555D.6 46.48,18.41 47.75,17.14 NE555D.2

### Text on the board
tPlace: 2 | 2 | 4 | 3 | 1 | 1 | 2 | 1
tNames: INPUT | POWER | OUTPUT | Iowa Formula | Inputs: | 1. BSE_PROCESSED / 2. MOTCUR_PROCESSED | Outputs: | Author: github.com/michaelpass | Brake System Plausibility Device (BSPD) Board / Rev A: 05/05/19 | 1. BSPDPLAUS1 / 2. BSPDPLAUS2 / 3. BSPDFAULT